# Altium schematic sheet LIN_EXPO.SchDoc
size C; SheetNumber: 1; SheetTotal: 1
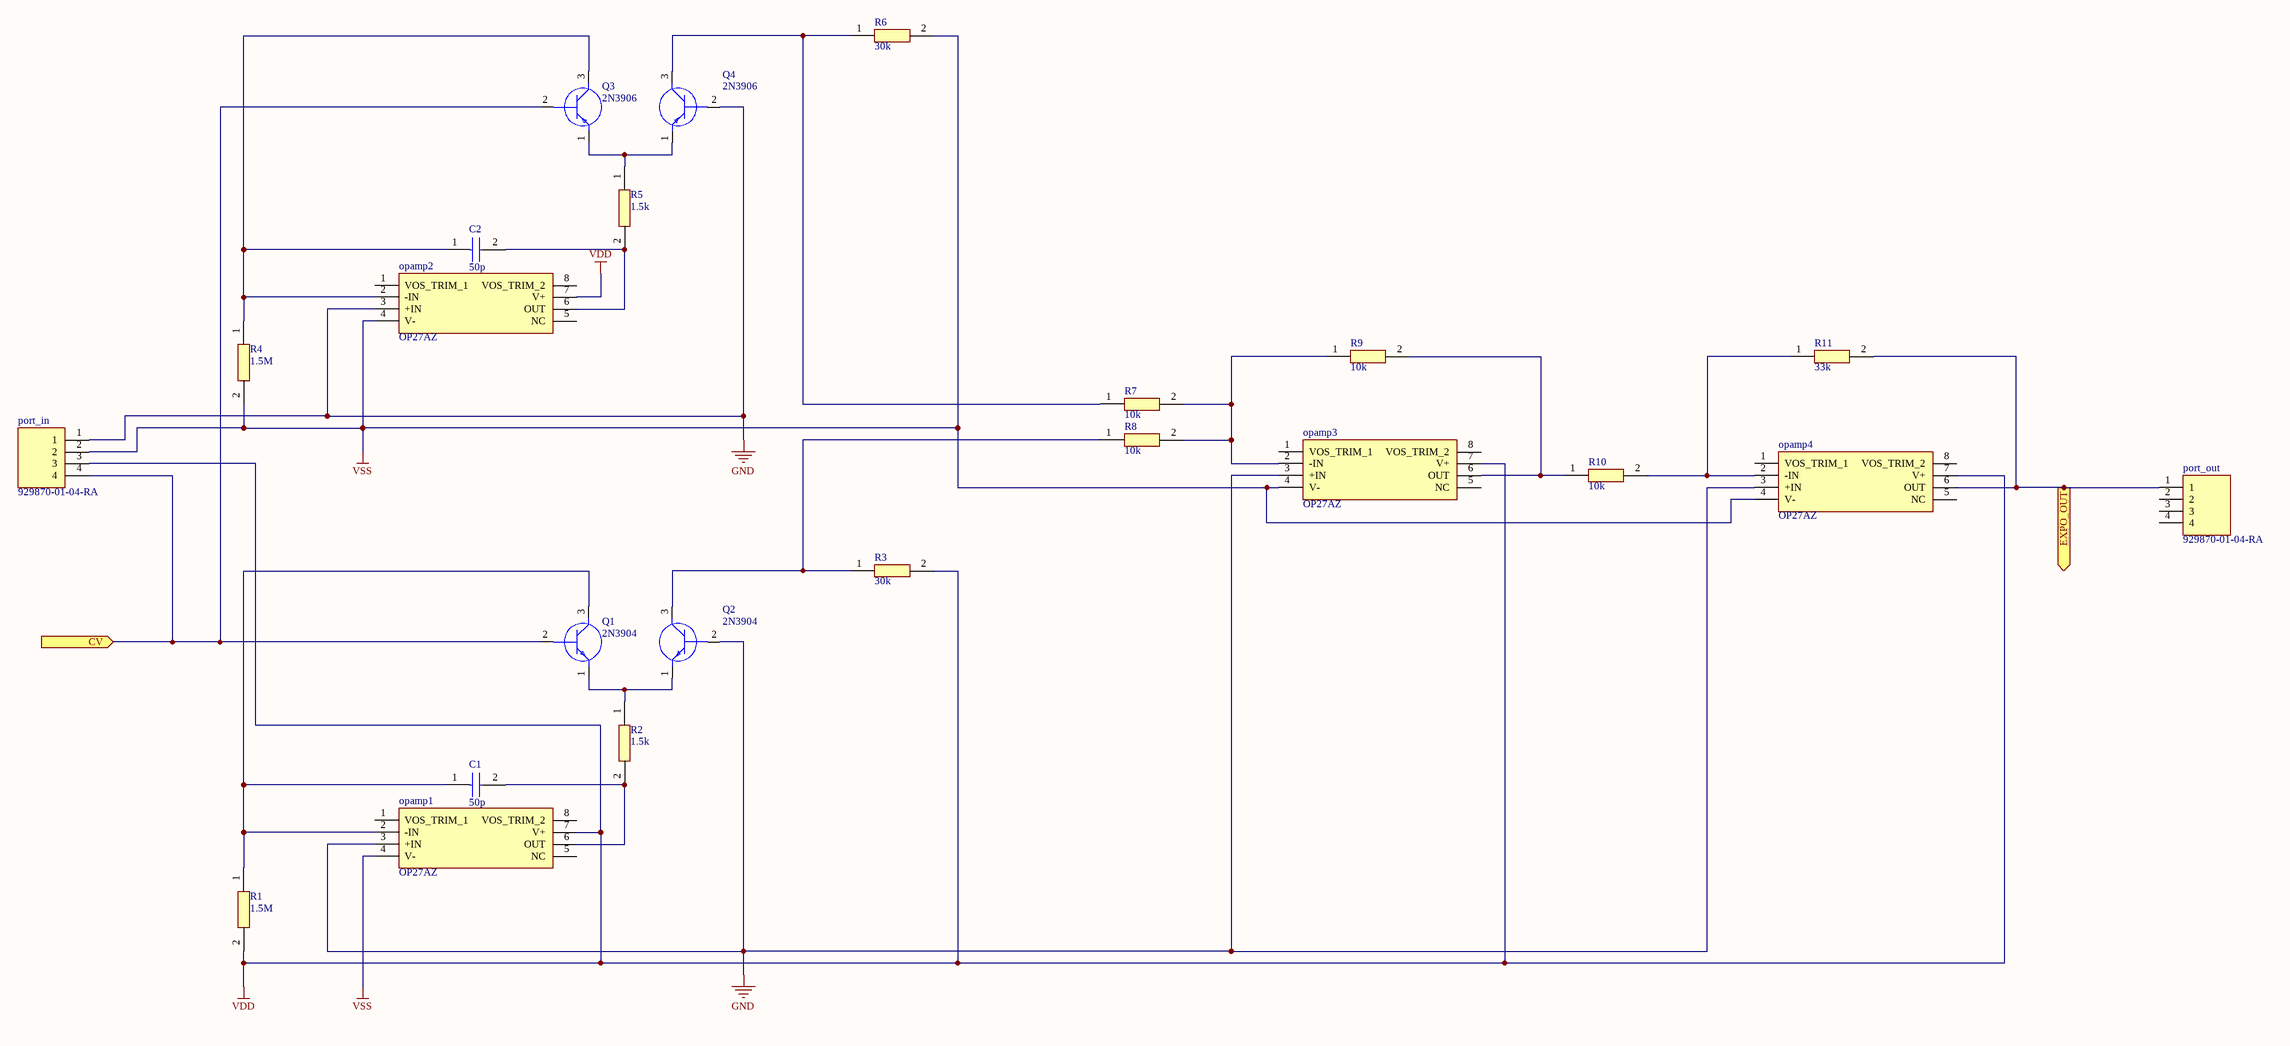
[diagram p0: LIN_EXPO.SchDoc]

## Parts
C1  50p  [CAPPA2400W30L800D400]
C2  50p  [CAPPA2400W30L800D400]
opamp1  OP27AZ  [DIP775W58P254L1029H508Q8N]
opamp2  OP27AZ  [DIP775W58P254L1029H508Q8N]
opamp3  OP27AZ  [DIP775W58P254L1029H508Q8N]
opamp4  OP27AZ  [DIP775W58P254L1029H508Q8N]
port_in  929870-01-04-RA  [RHDR4W76P0X254_1X4_1016X254X826P]
port_out  929870-01-04-RA  [RHDR4W76P0X254_1X4_1016X254X826P]
Q1  2N3904  [CS_TO-92]
Q2  2N3904  [CS_TO-92]
Q3  2N3906  [2N5457]
Q4  2N3906  [2N5457]
R1  1.5M  [RESAD1650W60L650D250]
R2  1.5k  [RESAD1650W60L650D250]
R3  30k  [RESAD1650W60L650D250]
R4  1.5M  [RESAD1650W60L650D250]
R5  1.5k  [RESAD1650W60L650D250]
R6  30k  [RESAD1650W60L650D250]
R7  10k  [RESAD1650W60L650D250]
R8  10k  [RESAD1650W60L650D250]
R9  10k  [RESAD1650W60L650D250]
R10  10k  [RESAD1650W60L650D250]
R11  33k  [RESAD1650W60L650D250]

## Ports
CV (in), EXPO_OUT (out)

## Nets
GND: opamp1.3(+IN) opamp2.3(+IN) opamp3.3(+IN) opamp4.3(+IN) port_in.1 Q2.2(B) Q4.2(B)
VDD: opamp1.7(V+) opamp2.7(V+) opamp3.7(V+) opamp4.7(V+) port_in.3 R1.2 R3.2
VSS: opamp1.4(V-) opamp2.4(V-) opamp3.4(V-) opamp4.4(V-) port_in.2 R4.2 R6.2
CV: port_in.4 Q1.2(B) Q3.2(B) ; port CV
EXPO_OUT: opamp4.6(OUT) port_out.1 R11.2 ; port EXPO_OUT
NetC1_1: C1.1(+) opamp1.2(-IN) Q1.3(C) R1.1
NetC1_2: C1.2(-) opamp1.6(OUT) R2.2
NetC2_1: C2.1(+) opamp2.2(-IN) Q3.3(C) R4.1
NetC2_2: C2.2(-) opamp2.6(OUT) R5.2
Netopamp3_2: opamp3.2(-IN) R7.2 R8.2 R9.1
Netopamp3_6: opamp3.6(OUT) R9.2 R10.1
Netopamp4_2: opamp4.2(-IN) R10.2 R11.1
NetQ1_1: Q1.1(E) Q2.1(E) R2.1
NetQ2_3: Q2.3(C) R3.1 R8.1
NetQ3_1: Q3.1(E) Q4.1(E) R5.1
NetQ4_3: Q4.3(C) R6.1 R7.1

Not connected (* = marked no-connect by the designer): opamp1 1(VOS_TRIM_1) 5(NC) 8(VOS_TRIM_2); opamp2 1(VOS_TRIM_1) 5(NC) 8(VOS_TRIM_2); opamp3 1(VOS_TRIM_1) 5(NC) 8(VOS_TRIM_2); opamp4 1(VOS_TRIM_1) 5(NC) 8(VOS_TRIM_2); port_out 2 3 4

## Library data of the parts
C1 C2 = 0113207: Capacitor; Manufacturer_Name: RS Pro; Datasheet Link: https://docs.rs-online.com/d68c/0900766b8157e121.pdf; Manufacturer_Part_Number: 0113207
opamp1-opamp4 = OP27AZ: Integrated Circuit; Manufacturer_Name: Analog Devices; Datasheet Link: https://www.analog.com/media/en/technical-documentation/data-sheets/OP27.pdf; Height: 5.08mm; Manufacturer_Part_Number: OP27AZ; Mouser Part Number: 700-OP27AZNR; Mouser Price/Stock: https://www.mouser.co.uk/ProductDetail/Maxim-Integrated/OP27AZ?qs=7RslVrYcaDTFV9h3XrpsTA%3D%3D; Arrow Part Number: OP27AZ; Arrow Price/Stock: https://www.arrow.com/en/products/op27az/analog-devices
port_in port_out = 929870-01-04-RA: Connector; Manufacturer_Name: 3M; Datasheet Link: https://componentsearchengine.com/Datasheets/2/929870-01-04-RA.pdf; Height: 8.26mm; Manufacturer_Part_Number: 929870-01-04-RA; Mouser Part Number: 517-929870-01-04-RA; Mouser Price/Stock: https://www.mouser.co.uk/ProductDetail/3M-Electronic-Solutions-Division/929870-01-04-RA?qs=neFkstNq%252B6GPZEKactAgTg%3D%3D; Arrow Part Number: 929870-01-04-RA; Arrow Price/Stock: https://www.arrow.com/en/products/929870-01-04-ra/3m
Q1 Q2 = 2N3904: Transistor BJT NPN; Manufacturer_Name: Central Semiconductor; Datasheet Link: https://my.centralsemi.com/get_document.php?cmp=1&mergetype=pd&mergepath=pd&pdf_id=2N3903.PDF; Manufacturer_Part_Number: 2N3904; Mouser Part Number: 610-2N3904; Mouser Price/Stock: https://www.mouser.com/Search/Refine.aspx?Keyword=610-2N3904
Q3 Q4 = 2N3906: Transistor BJT PNP; Manufacturer_Name: Central Semiconductor; Datasheet Link: http://www.mouser.com/datasheet/2/68/2n3905-29545.pdf; Height: 5.33mm; Manufacturer_Part_Number: 2N3906; Mouser Part Number: 610-2N3906; Mouser Price/Stock: https://www.mouser.com/Search/Refine.aspx?Keyword=610-2N3906; Arrow Part Number: 2N3906; Arrow Price/Stock: https://www.arrow.com/en/products/2n3906/central-semiconductor?region=nac
R1-R11 = MRS25000C1003FC100: Resistor; Manufacturer_Name: Vishay; Datasheet Link: http://www.vishay.com/docs/28724/mrs16m25.pdf; Manufacturer_Part_Number: MRS25000C1003FC100; Mouser Part Number: 594-MRS25000C1003FC1; Mouser Price/Stock: https://www.mouser.co.uk/ProductDetail/Vishay-BC-Components/MRS25000C1003FC100?qs=H30XFsNYD%2FHyk6mBpuomxg%3D%3D; Arrow Part Number: MRS25000C1003FC100; Arrow Price/Stock: https://www.arrow.com/en/products/mrs25000c1003fc100/vishay?region=nac